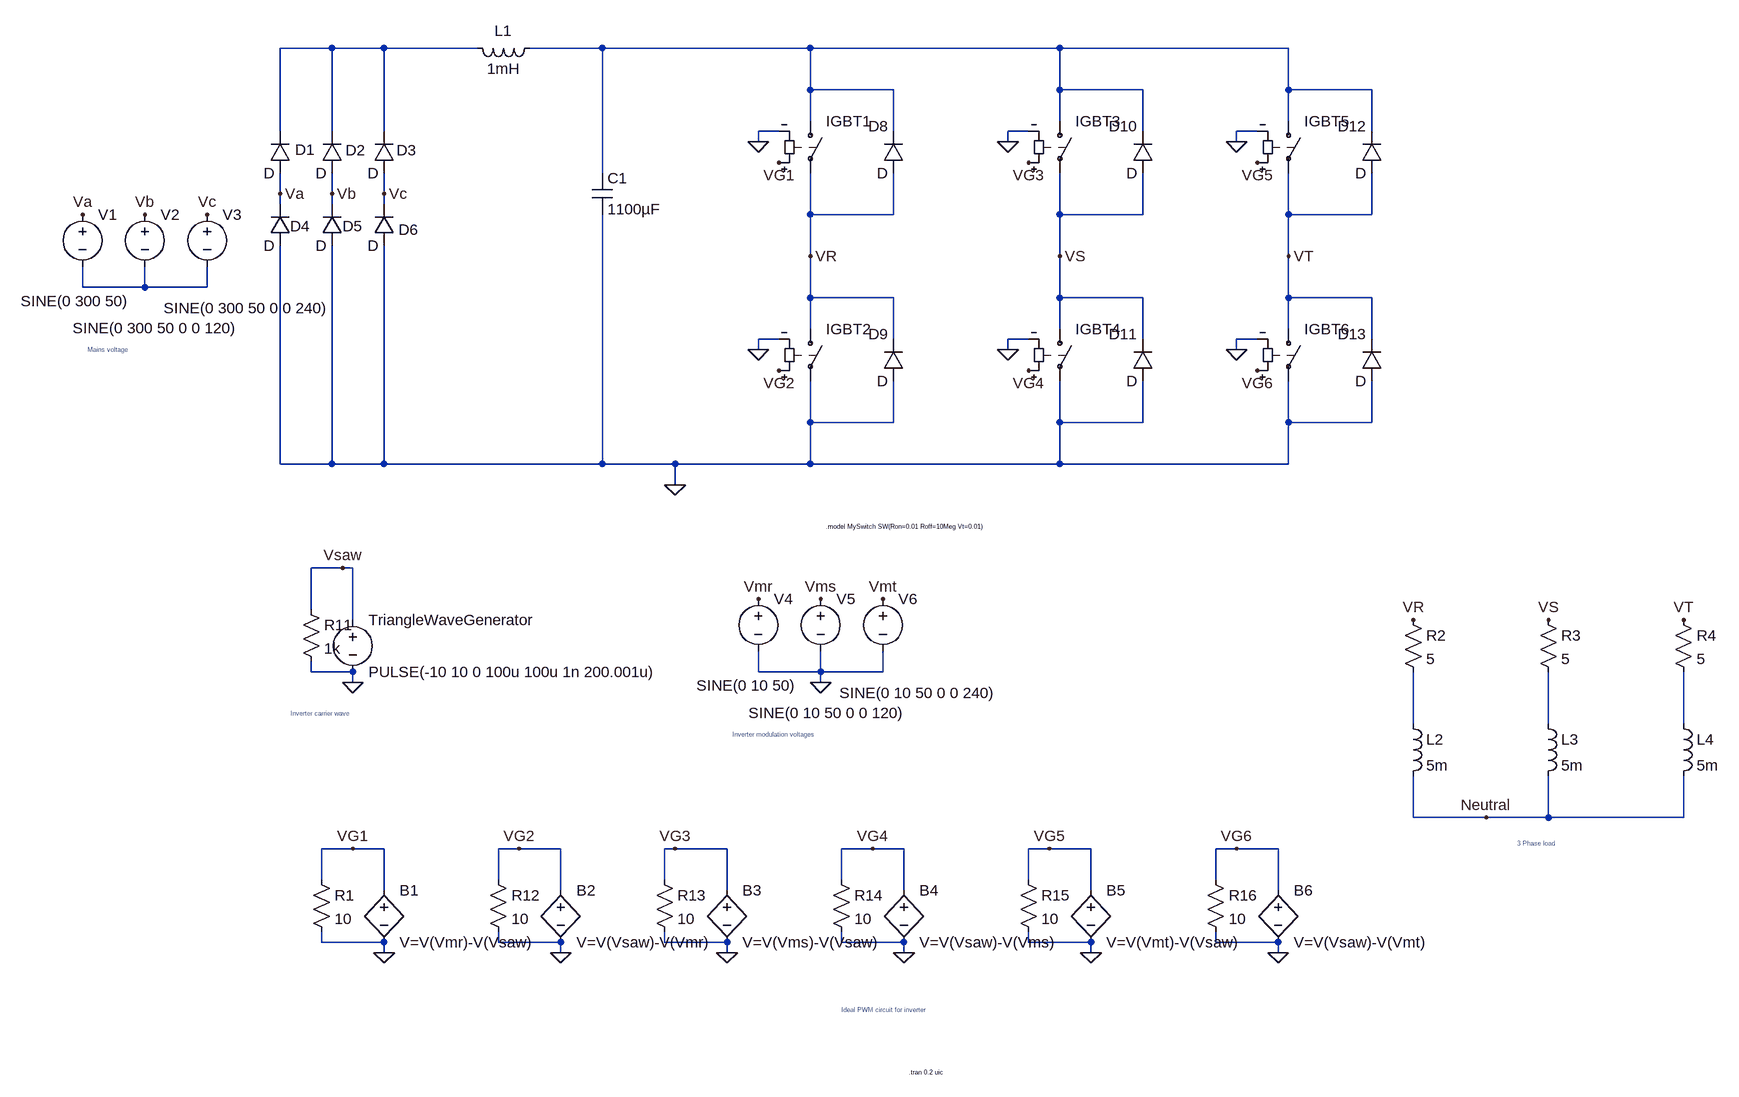
[diagram p0: schematic Three phase Inverter with resistor & inductive.asc]
Three phase Inverter with resistor & inductive.asc, the LTspice schematic file:
Version 4
SHEET 1 3872 1864
WIRE 112 -32 32 -32
WIRE 192 -32 112 -32
WIRE 336 -32 192 -32
WIRE 528 -32 416 -32
WIRE 848 -32 528 -32
WIRE 1232 -32 848 -32
WIRE 1584 -32 1232 -32
WIRE 848 32 848 -32
WIRE 976 32 848 32
WIRE 1232 32 1232 -32
WIRE 1360 32 1232 32
WIRE 1584 32 1584 -32
WIRE 1712 32 1584 32
WIRE 848 80 848 32
WIRE 1232 80 1232 32
WIRE 1584 80 1584 32
WIRE 32 96 32 -32
WIRE 112 96 112 -32
WIRE 192 96 192 -32
WIRE 800 96 768 96
WIRE 976 96 976 32
WIRE 1184 96 1152 96
WIRE 1360 96 1360 32
WIRE 1536 96 1504 96
WIRE 1712 96 1712 32
WIRE 768 112 768 96
WIRE 1152 112 1152 96
WIRE 1504 112 1504 96
WIRE 528 160 528 -32
WIRE 32 192 32 160
WIRE 112 192 112 160
WIRE 192 192 192 160
WIRE 32 208 32 192
WIRE 112 208 112 192
WIRE 192 208 192 192
WIRE 848 224 848 160
WIRE 976 224 976 160
WIRE 976 224 848 224
WIRE 1232 224 1232 160
WIRE 1360 224 1360 160
WIRE 1360 224 1232 224
WIRE 1584 224 1584 160
WIRE 1712 224 1712 160
WIRE 1712 224 1584 224
WIRE 848 288 848 224
WIRE 1232 288 1232 224
WIRE 1584 288 1584 224
WIRE -272 336 -272 304
WIRE -176 336 -176 304
WIRE -176 336 -272 336
WIRE -80 336 -80 304
WIRE -80 336 -176 336
WIRE 848 352 848 288
WIRE 976 352 848 352
WIRE 1232 352 1232 288
WIRE 1360 352 1232 352
WIRE 1584 352 1584 288
WIRE 1712 352 1584 352
WIRE 848 400 848 352
WIRE 1232 400 1232 352
WIRE 1584 400 1584 352
WIRE 800 416 768 416
WIRE 976 416 976 352
WIRE 1184 416 1152 416
WIRE 1360 416 1360 352
WIRE 1536 416 1504 416
WIRE 1712 416 1712 352
WIRE 768 432 768 416
WIRE 1152 432 1152 416
WIRE 1504 432 1504 416
WIRE 848 544 848 480
WIRE 976 544 976 480
WIRE 976 544 848 544
WIRE 1232 544 1232 480
WIRE 1360 544 1360 480
WIRE 1360 544 1232 544
WIRE 1584 544 1584 480
WIRE 1712 544 1712 480
WIRE 1712 544 1584 544
WIRE 32 608 32 272
WIRE 112 608 112 272
WIRE 112 608 32 608
WIRE 192 608 192 272
WIRE 192 608 112 608
WIRE 528 608 528 224
WIRE 528 608 192 608
WIRE 640 608 528 608
WIRE 848 608 848 544
WIRE 848 608 640 608
WIRE 1232 608 1232 544
WIRE 1232 608 848 608
WIRE 1584 608 1584 544
WIRE 1584 608 1232 608
WIRE 640 640 640 608
WIRE 128 768 80 768
WIRE 144 768 128 768
WIRE 80 832 80 768
WIRE 144 848 144 768
WIRE 80 928 80 912
WIRE 144 928 80 928
WIRE 768 928 768 896
WIRE 864 928 864 896
WIRE 864 928 768 928
WIRE 960 928 960 896
WIRE 960 928 864 928
WIRE 144 944 144 928
WIRE 864 944 864 928
WIRE 1776 1008 1776 928
WIRE 1984 1008 1984 928
WIRE 2192 1008 2192 928
WIRE 1776 1152 1776 1088
WIRE 1888 1152 1776 1152
WIRE 1984 1152 1984 1088
WIRE 1984 1152 1888 1152
WIRE 2192 1152 2192 1088
WIRE 2192 1152 1984 1152
WIRE 144 1200 96 1200
WIRE 192 1200 144 1200
WIRE 400 1200 368 1200
WIRE 464 1200 400 1200
WIRE 640 1200 624 1200
WIRE 720 1200 640 1200
WIRE 944 1200 896 1200
WIRE 992 1200 944 1200
WIRE 1216 1200 1184 1200
WIRE 1280 1200 1216 1200
WIRE 1504 1200 1472 1200
WIRE 1568 1200 1504 1200
WIRE 96 1248 96 1200
WIRE 368 1248 368 1200
WIRE 624 1248 624 1200
WIRE 896 1248 896 1200
WIRE 1184 1248 1184 1200
WIRE 1472 1248 1472 1200
WIRE 192 1264 192 1200
WIRE 464 1264 464 1200
WIRE 720 1264 720 1200
WIRE 992 1264 992 1200
WIRE 1280 1264 1280 1200
WIRE 1568 1264 1568 1200
WIRE 96 1344 96 1328
WIRE 192 1344 96 1344
WIRE 368 1344 368 1328
WIRE 464 1344 368 1344
WIRE 624 1344 624 1328
WIRE 720 1344 624 1344
WIRE 896 1344 896 1328
WIRE 992 1344 896 1344
WIRE 1184 1344 1184 1328
WIRE 1280 1344 1184 1344
WIRE 1472 1344 1472 1328
WIRE 1568 1344 1472 1344
WIRE 192 1360 192 1344
WIRE 464 1360 464 1344
WIRE 720 1360 720 1344
WIRE 992 1360 992 1344
WIRE 1280 1360 1280 1344
WIRE 1568 1360 1568 1344
FLAG 32 192 Va
FLAG 112 192 Vb
FLAG 192 192 Vc
FLAG -272 224 Va
FLAG -176 224 Vb
FLAG -80 224 Vc
FLAG 640 640 0
FLAG 768 112 0
FLAG 800 144 VG1
FLAG 768 432 0
FLAG 800 464 VG2
FLAG 1152 112 0
FLAG 1184 144 VG3
FLAG 1152 432 0
FLAG 1184 464 VG4
FLAG 1504 112 0
FLAG 1536 144 VG5
FLAG 1504 432 0
FLAG 1536 464 VG6
FLAG 848 288 VR
FLAG 1232 288 VS
FLAG 1584 288 VT
FLAG 1776 848 VR
FLAG 1984 848 VS
FLAG 2192 848 VT
FLAG 1888 1152 Neutral
FLAG 144 944 0
FLAG 128 768 Vsaw
FLAG 768 816 Vmr
FLAG 864 816 Vms
FLAG 960 816 Vmt
FLAG 144 1200 VG1
FLAG 400 1200 VG2
FLAG 640 1200 VG3
FLAG 944 1200 VG4
FLAG 1216 1200 VG5
FLAG 1504 1200 VG6
FLAG 864 944 0
FLAG 192 1360 0
FLAG 464 1360 0
FLAG 720 1360 0
FLAG 992 1360 0
FLAG 1280 1360 0
FLAG 1568 1360 0
SYMBOL diode 48 160 R180
WINDOW 0 -38 36 Left 2
WINDOW 3 24 0 Left 2
SYMATTR InstName D1
SYMBOL diode 128 160 R180
WINDOW 0 -36 35 Left 2
WINDOW 3 24 0 Left 2
SYMATTR InstName D2
SYMBOL diode 208 160 R180
WINDOW 0 -34 35 Left 2
WINDOW 3 24 0 Left 2
SYMATTR InstName D3
SYMBOL diode 48 272 R180
WINDOW 0 -30 30 Left 2
WINDOW 3 24 0 Left 2
SYMATTR InstName D4
SYMBOL diode 128 272 R180
WINDOW 0 -31 30 Left 2
WINDOW 3 24 0 Left 2
SYMATTR InstName D5
SYMBOL diode 208 272 R180
WINDOW 0 -37 25 Left 2
WINDOW 3 24 0 Left 2
SYMATTR InstName D6
SYMBOL voltage -272 208 R0
WINDOW 3 -95 149 Left 2
WINDOW 123 0 0 Left 2
WINDOW 39 0 0 Left 2
SYMATTR Value SINE(0 300 50)
SYMATTR InstName V1
SYMBOL voltage -176 208 R0
WINDOW 3 -111 191 Left 2
WINDOW 123 0 0 Left 2
WINDOW 39 0 0 Left 2
SYMATTR Value SINE(0 300 50 0 0 120)
SYMATTR InstName V2
SYMBOL voltage -80 208 R0
WINDOW 3 -67 160 Left 2
WINDOW 123 0 0 Left 2
WINDOW 39 0 0 Left 2
SYMATTR Value SINE(0 300 50 0 0 240)
SYMATTR InstName V3
SYMBOL ind 432 -48 R90
WINDOW 0 5 56 VBottom 2
WINDOW 3 32 56 VTop 2
SYMATTR InstName L1
SYMATTR Value 1mH
SYMBOL cap 512 160 R0
SYMATTR InstName C1
SYMATTR Value 1100µF
SYMBOL sw 848 64 R0
SYMATTR InstName IGBT1
SYMATTR Value ""
SYMATTR SpiceModel MySwitch
SYMBOL diode 992 160 R180
WINDOW 0 24 72 Left 2
WINDOW 3 24 0 Left 2
SYMATTR InstName D8
SYMBOL sw 848 384 R0
SYMATTR InstName IGBT2
SYMATTR Value ""
SYMATTR SpiceModel MySwitch
SYMBOL diode 992 480 R180
WINDOW 0 24 72 Left 2
WINDOW 3 24 0 Left 2
SYMATTR InstName D9
SYMBOL sw 1232 64 R0
SYMATTR InstName IGBT3
SYMATTR Value ""
SYMATTR SpiceModel MySwitch
SYMBOL diode 1376 160 R180
WINDOW 0 24 72 Left 2
WINDOW 3 24 0 Left 2
SYMATTR InstName D10
SYMBOL sw 1232 384 R0
SYMATTR InstName IGBT4
SYMATTR Value ""
SYMATTR SpiceModel MySwitch
SYMBOL diode 1376 480 R180
WINDOW 0 24 72 Left 2
WINDOW 3 24 0 Left 2
SYMATTR InstName D11
SYMBOL sw 1584 64 R0
SYMATTR InstName IGBT5
SYMATTR Value ""
SYMATTR SpiceModel MySwitch
SYMBOL diode 1728 160 R180
WINDOW 0 24 72 Left 2
WINDOW 3 24 0 Left 2
SYMATTR InstName D12
SYMBOL sw 1584 384 R0
SYMATTR InstName IGBT6
SYMATTR Value ""
SYMATTR SpiceModel MySwitch
SYMBOL diode 1728 480 R180
WINDOW 0 24 72 Left 2
WINDOW 3 24 0 Left 2
SYMATTR InstName D13
SYMBOL res 1760 832 R0
SYMATTR InstName R2
SYMATTR Value 5
SYMBOL res 1968 832 R0
SYMATTR InstName R3
SYMATTR Value 5
SYMBOL res 2176 832 R0
SYMATTR InstName R4
SYMATTR Value 5
SYMBOL voltage 144 832 R0
WINDOW 123 0 0 Left 2
WINDOW 39 0 0 Left 2
SYMATTR InstName TriangleWaveGenerator
SYMATTR Value PULSE(-10 10 0 100u 100u 1n 200.001u)
SYMBOL voltage 768 800 R0
WINDOW 3 -95 149 Left 2
WINDOW 123 0 0 Left 2
WINDOW 39 0 0 Left 2
SYMATTR Value SINE(0 10 50)
SYMATTR InstName V4
SYMBOL voltage 864 800 R0
WINDOW 3 -111 191 Left 2
WINDOW 123 0 0 Left 2
WINDOW 39 0 0 Left 2
SYMATTR Value SINE(0 10 50 0 0 120)
SYMATTR InstName V5
SYMBOL voltage 960 800 R0
WINDOW 3 -67 160 Left 2
WINDOW 123 0 0 Left 2
WINDOW 39 0 0 Left 2
SYMATTR Value SINE(0 10 50 0 0 240)
SYMATTR InstName V6
SYMBOL res 64 816 R0
SYMATTR InstName R11
SYMATTR Value 1k
SYMBOL bv 192 1248 R0
SYMATTR InstName B1
SYMATTR Value V=V(Vmr)-V(Vsaw)
SYMBOL res 80 1232 R0
SYMATTR InstName R1
SYMATTR Value 10
SYMBOL bv 464 1248 R0
SYMATTR InstName B2
SYMATTR Value V=V(Vsaw)-V(Vmr)
SYMBOL res 352 1232 R0
SYMATTR InstName R12
SYMATTR Value 10
SYMBOL bv 720 1248 R0
SYMATTR InstName B3
SYMATTR Value V=V(Vms)-V(Vsaw)
SYMBOL res 608 1232 R0
SYMATTR InstName R13
SYMATTR Value 10
SYMBOL bv 992 1248 R0
SYMATTR InstName B4
SYMATTR Value V=V(Vsaw)-V(Vms)
SYMBOL res 880 1232 R0
SYMATTR InstName R14
SYMATTR Value 10
SYMBOL bv 1280 1248 R0
SYMATTR InstName B5
SYMATTR Value V=V(Vmt)-V(Vsaw)
SYMBOL res 1168 1232 R0
SYMATTR InstName R15
SYMATTR Value 10
SYMBOL bv 1568 1248 R0
SYMATTR InstName B6
SYMATTR Value V=V(Vsaw)-V(Vmt)
SYMBOL res 1456 1232 R0
SYMATTR InstName R16
SYMATTR Value 10
SYMBOL ind 1760 992 R0
SYMATTR InstName L2
SYMATTR Value 5m
SYMBOL ind 1968 992 R0
SYMATTR InstName L3
SYMATTR Value 5m
SYMBOL ind 2176 992 R0
SYMATTR InstName L4
SYMATTR Value 5m
TEXT 1000 1544 Left 0 !.tran 0.2 uic
TEXT 872 704 Left 0 !.model MySwitch SW(Ron=0.01 Roff=10Meg Vt=0.01)
TEXT 728 1024 Left 0 ;Inverter modulation voltages
TEXT 48 992 Left 0 ;Inverter carrier wave
TEXT 1936 1192 Left 0 ;3 Phase load
TEXT 896 1448 Left 0 ;Ideal PWM circuit for inverter
TEXT -264 432 Left 0 ;Mains voltage

The netlist it stands for:
* Three phase Inverter with resistor & inductive.asc
D1 Va N001 D
D2 Vb N001 D
D3 Vc N001 D
D4 0 Va D
D5 0 Vb D
D6 0 Vc D
V1 Va N003 SINE(0 300 50)
V2 Vb N003 SINE(0 300 50 0 0 120)
V3 Vc N003 SINE(0 300 50 0 0 240)
L1 N002 N001 1mH
C1 N002 0 1100µF
S§IGBT1 N002 VR VG1 0 MySwitch
D8 VR N002 D
S§IGBT2 VR 0 VG2 0 MySwitch
D9 0 VR D
S§IGBT3 N002 VS VG3 0 MySwitch
D10 VS N002 D
S§IGBT4 VS 0 VG4 0 MySwitch
D11 0 VS D
S§IGBT5 N002 VT VG5 0 MySwitch
D12 VT N002 D
S§IGBT6 VT 0 VG6 0 MySwitch
D13 0 VT D
R2 VR N004 5
R3 VS N005 5
R4 VT N006 5
V§TriangleWaveGenerator Vsaw 0 PULSE(-10 10 0 100u 100u 1n 200.001u)
V4 Vmr 0 SINE(0 10 50)
V5 Vms 0 SINE(0 10 50 0 0 120)
V6 Vmt 0 SINE(0 10 50 0 0 240)
R11 Vsaw 0 1k
B1 VG1 0 V=V(Vmr)-V(Vsaw)
R1 VG1 0 10
B2 VG2 0 V=V(Vsaw)-V(Vmr)
R12 VG2 0 10
B3 VG3 0 V=V(Vms)-V(Vsaw)
R13 VG3 0 10
B4 VG4 0 V=V(Vsaw)-V(Vms)
R14 VG4 0 10
B5 VG5 0 V=V(Vmt)-V(Vsaw)
R15 VG5 0 10
B6 VG6 0 V=V(Vsaw)-V(Vmt)
R16 VG6 0 10
L2 N004 Neutral 5m
L3 N005 Neutral 5m
L4 N006 Neutral 5m
.model D D
.lib standard.dio
.tran 0.2 uic
.model MySwitch SW(Ron=0.01 Roff=10Meg Vt=0.01)
* Inverter modulation voltages
* Inverter carrier wave
* 3 Phase load
* Ideal PWM circuit for inverter
* Mains voltage
.backanno
.end